# Altium schematic sheet FPGA_SPI_interface.SchDoc: foxBMS BMS-Master
size A3; DocumentNumber: 23; SheetNumber: 23; SheetTotal: 24; Author: Fraunhofer IISB foxBMS Team; REL-DATE: 2017-05-16; VERSION: 1.0.2; SheetDescription: FPGA SPI Interface up to 45MHz
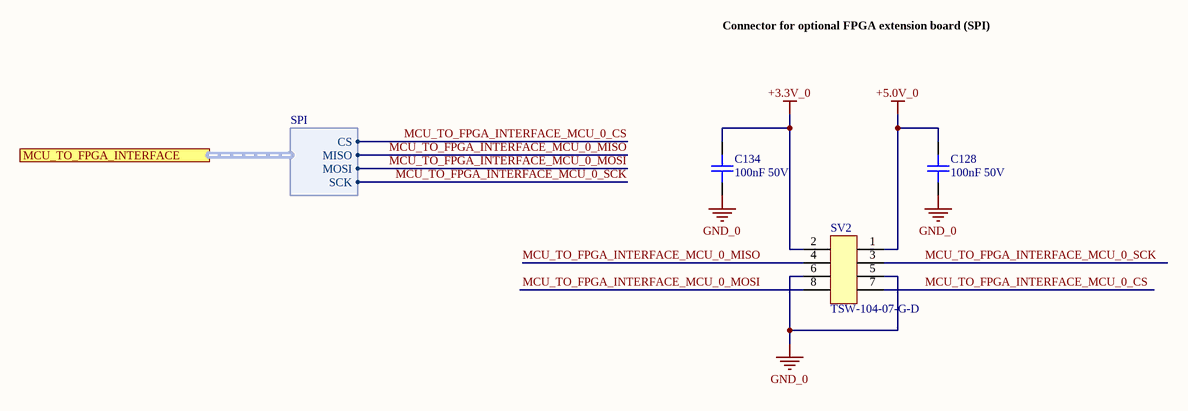
[diagram p0: FPGA_SPI_interface.SchDoc]

## Parts
C128  100nF 50V  [0603C]
C134  100nF 50V  [0603C]
SV2  TSW-104-07-G-D  [Pinheader_2.54_2x4]

## Ports
MCU_TO_FPGA_INTERFACE (harness SPI)

## Harnesses
SPI: CS, MISO, MOSI, SCK

## Nets
+3.3V_0: C134.2 SV2.2
+5.0V_0: C128.1 SV2.1
GND_0: C128.2 C134.1 SV2.5 SV2.6
MCU_TO_FPGA_INTERFACE_MCU_0_CS: SV2.7 ; port MCU_TO_FPGA_INTERFACE.CS
MCU_TO_FPGA_INTERFACE_MCU_0_MISO: SV2.4 ; port MCU_TO_FPGA_INTERFACE.MISO
MCU_TO_FPGA_INTERFACE_MCU_0_MOSI: SV2.8 ; port MCU_TO_FPGA_INTERFACE.MOSI
MCU_TO_FPGA_INTERFACE_MCU_0_SCK: SV2.3 ; port MCU_TO_FPGA_INTERFACE.SCK

## Notes on the sheet
- Connector for optional FPGA extension board (SPI)
- Fraunhofer IISB
- Schottkystr. 10
- developed by:
- 91058 Erlangen
- Germany
- Author
- Project
- License
- Description
- File
- Version
- Release Date
- Sheet
- www.foxbms.org
- www.iisb.fraunhofer.de
- foxBMS Team
- /

## Library data of the parts
C128 C134 = gen_C_ceramic_100n_50V_X7R_0603: Ceramic, 100nF, ±10%, 50V, X7R, –55 to 125°C, 0603 (1608),RoHS, Automotive; Part Number: GCJ188R71H104KA12; Manufacturer: Murata; Capacitance: 100n; Case EIA: 0603; Case Metric: 1608; PnP Package: C_0603_10; PnP Value: 100nF/50V/X7R; PnP equipped: x; Automotive Qualified: True; Rated Voltage: 50V; Dielectric: X7R; Supplier 1: Digi-Key; Supplier Part Number 1: 490-5798-1-ND; Height - Seated (Max): 0.8mm; Mounting Type: SurfaceMount,MLCC; Operating Temperature: –55 to 125°C; Series: GCJ; Tolerance: ±10%; Manufacturer_Part_Number: GCJ188R71H104KA12
SV2 = samtec_TSW-104-07-G-D: Board-To-Board Connector, Vertical, 2.54 mm, 8 Contacts, Header, TSW Series, Through Hole, 2 Rows; Manufacturer: Samtec; Circuits: 8; Rated Voltage: 500V AC mated with SSW; Automotive Qualified: False; Part Number: TSW-104-07-G-D; Part Name: TSW-104-07-G-D; Operating Temperature: -55°C - +125°C; ComponentLink1Description: Datasheet; ComponentLink1URL: http://www.farnell.com/datasheets/1992055.pdf; Supplier 1: Farnell; Supplier Part Number 1: 2025250; System: Connector